# EAGLE schematic C (EAGLE 7.5.0)
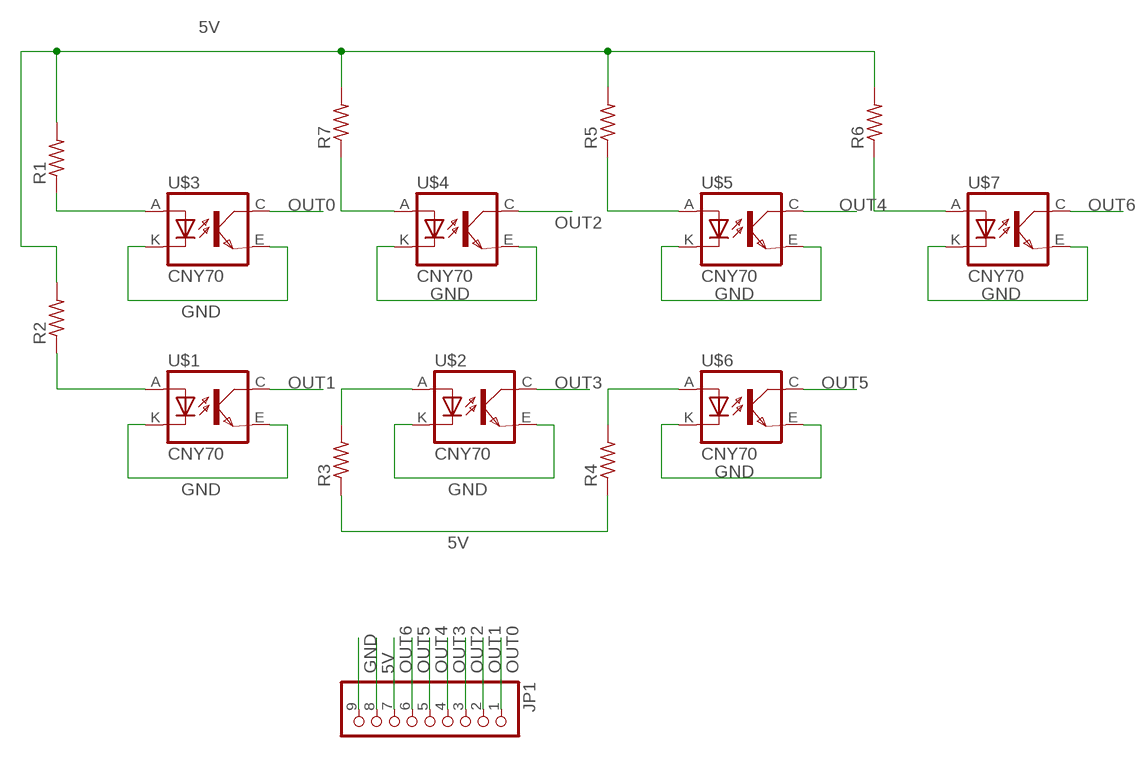
[diagram p0: schematic, sheet 1]

## Parts
JP1  PINHD-1X9  [1X09]
R1  R-US_R0805  [R0805]
R2  R-US_R0805  [R0805]
R3  R-US_R0805  [R0805]
R4  R-US_R0805  [R0805]
R5  R-US_R0805  [R0805]
R6  R-US_R0805  [R0805]
R7  R-US_R0805  [R0805]
U$1  CNY70  [4]
U$2  CNY70  [4]
U$3  CNY70  [4]
U$4  CNY70  [4]
U$5  CNY70  [4]
U$6  CNY70  [4]
U$7  CNY70  [4]

## Nets
5V: JP1.8 R1.2 R2.2 R3.1 R4.1 R5.2 R6.2 R7.2
GND: JP1.9 U$1.E(EMI) U$1.K(C) U$2.E(EMI) U$2.K(C) U$3.E(EMI) U$3.K(C) U$4.E(EMI) U$4.K(C) U$5.E(EMI) U$5.K(C) U$6.E(EMI) U$6.K(C) U$7.E(EMI) U$7.K(C)
N$1: R2.1 U$1.A
N$3: R3.2 U$2.A
N$5: R1.1 U$3.A
N$7: R7.1 U$4.A
N$11: R5.1 U$5.A
N$13: R4.2 U$6.A
N$15: R6.1 U$7.A
OUT0: JP1.1 U$3.C(COL)
OUT1: JP1.2 U$1.C(COL)
OUT2: JP1.3 U$4.C(COL)
OUT3: JP1.4 U$2.C(COL)
OUT4: JP1.5 U$5.C(COL)
OUT5: JP1.6 U$6.C(COL)
OUT6: JP1.7 U$7.C(COL)

## Library data of the parts
JP1 = pinhead:PINHD-1X9: PIN HEADER
R1-R7 = resistor:R-US_: RESISTOR, American symbol
U$1-U$7 = cny70:CNY70